# Altium schematic sheet Alimentacion.SchDoc
size A4
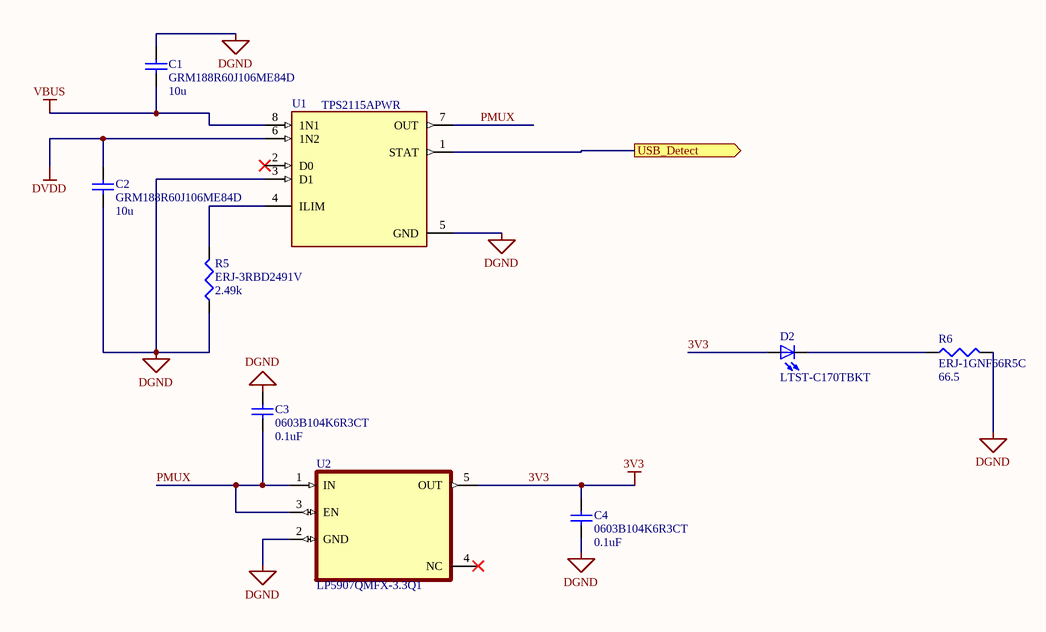
[diagram p0: Alimentacion.SchDoc]

## Parts
C1  GRM188R60J106ME84D  value 10u  [1608[0603]]
C2  GRM188R60J106ME84D  value 10u  [1608[0603]]
C3  0603B104K6R3CT  value 0.1uF  [1608[0603]]
C4  0603B104K6R3CT  value 0.1uF  [1608[0603]]
D2  LTST-C170TBKT  [DIOC200X125X110]
R5  ERJ-3RBD2491V  value 2.49k  [J1-0603]
R6  ERJ-1GNF66R5C  value 66.5  [J1-0603]
U1  TPS2115APWR  [SOP65P640X120-8N]
U2  LP5907QMFX-3.3Q1  [SOT95P280X145-5N]

## Ports
USB_Detect (out)

## Nets
3V3: C4.2 D2.POS U2.5(OUT)
DGND: C1.2 C2.1 C3.2 C4.1 R5.1 R6.2 U1.3(D1) U1.5(GND) U2.2(GND)
DVDD: C2.2 U1.6(1N2)
VBUS: C1.1 U1.8(1N1)
PMUX: C3.1 U1.7(OUT) U2.1(IN) U2.3(EN)
USB_Detect: U1.1(STAT) ; port USB_Detect
NetD2_NEG: D2.NEG R6.1
NetR5_2: R5.2 U1.4(ILIM)

Not connected (* = marked no-connect by the designer): U1 2(D0)*; U2 4(NC)*

## Library data of the parts
C1-C4 = Cap Semi: Capacitor (Semiconductor SIM Model); Published: 8-Jun-2000; LatestRevisionDate: 29-May-2009; LatestRevisionNote: IPC-7351 Footprint Added.; PackageReference: C1206; Publisher: Altium Limited; PackageDescription: Chip Capacitor; Supplier 1: Mouser
  C1 C2: Supplier Part Number 1: 81-GRM188R60J106ME4D; Supplier 2: Digi-Key; Supplier Part Number 2: 490-7316-6-ND
  C3 C4: Supplier Part Number 1: 791-0603B104K6R3CT
D2 = LTST-C170TBKT: Blue 470nm LED Indication - Discrete 3.3V 0805 _2012 Metric_; MF: Lite-On Inc.; SnapEDA_Link: https://www.snapeda.com/parts/LTST-C170TBKT/Lite-On%20Inc./view-part/217848/?ref=snap; MP: LTST-C170TBKT; Value: *; Digi-Key_Part_Number: 160-1579-1-ND; Digi-Key_Purchase_URL: https://www.digikey.jp/product-detail/en/lite-on-inc/LTST-C170TBKT/160-1579-1-ND/564889?utm_source=snapeda&utm_medium=aggregator&utm_campaign=symbol; Package: 0805 Lite-On; Supplier 1: Digi-Key; Supplier Part Number 1: 160-1579-6-ND; Supplier 2: RSComponents; Supplier Part Number 2: 6920913; Supplier 3: Mouser; Supplier Part Number 3: 859-LTST-C170TBKT
R5 R6 = Res3: Resistor; Published: 8-Jun-2000; LatestRevisionDate: 29-May-2009; LatestRevisionNote: IPC-7351 Footprint Added.; PackageReference: J1-0603; Publisher: Altium Limited; PackageDescription: Chip Resistor; Supplier 1: Mouser
  R5: Supplier Part Number 1: 667-ERJ-3RBD2491V
  R6: Supplier Part Number 1: 667-ERJ-1GNF66R5C
U1 = TPS2115APWR: 2.8-5.5-V, 84-m?, 1.25-A, power mux with manual, automatic switchover and status output 8-TSSOP -40 to 85; Package: None; Availability: Unavailable; Price: None; Value: *; MP: TPS2115APWR; Supplier 1: Mouser; Supplier Part Number 1: 595-TPS2115APWR; Supplier 2: Digi-Key; Supplier Part Number 2: 296-16940-6-ND
U2 = LP5907QMFX-3.3Q1: Automotive 250-mA, low-noise, high-PSRR, low-IQ, ultra-low-dropout voltage regulator with low-IQ 5-SOT-23 -40 to 125; MF: Texas Instruments; Purchase-URL: https://pricing.snapeda.com/search/part/LP5907QMFX-3.3Q1/?ref=eda; Availability: Good; SnapEDA_Link: https://www.snapeda.com/parts/LP5907QMFX-3.3Q1/Texas%20Instruments/view-part/559786/?ref=snap; Price: None; Package: SOT-23-5 Texas Instruments; Check_prices: https://www.snapeda.com/parts/LP5907QMFX-3.3Q1/Texas%20Instruments/view-part/559786/?ref=eda; Value: *; MP: LP5907QMFX-3.3Q1; Supplier 1: Mouser; Supplier Part Number 1: 595-LP5907QMFX-3.3Q1